# Altium project ETRX_RECU.PrjPcb
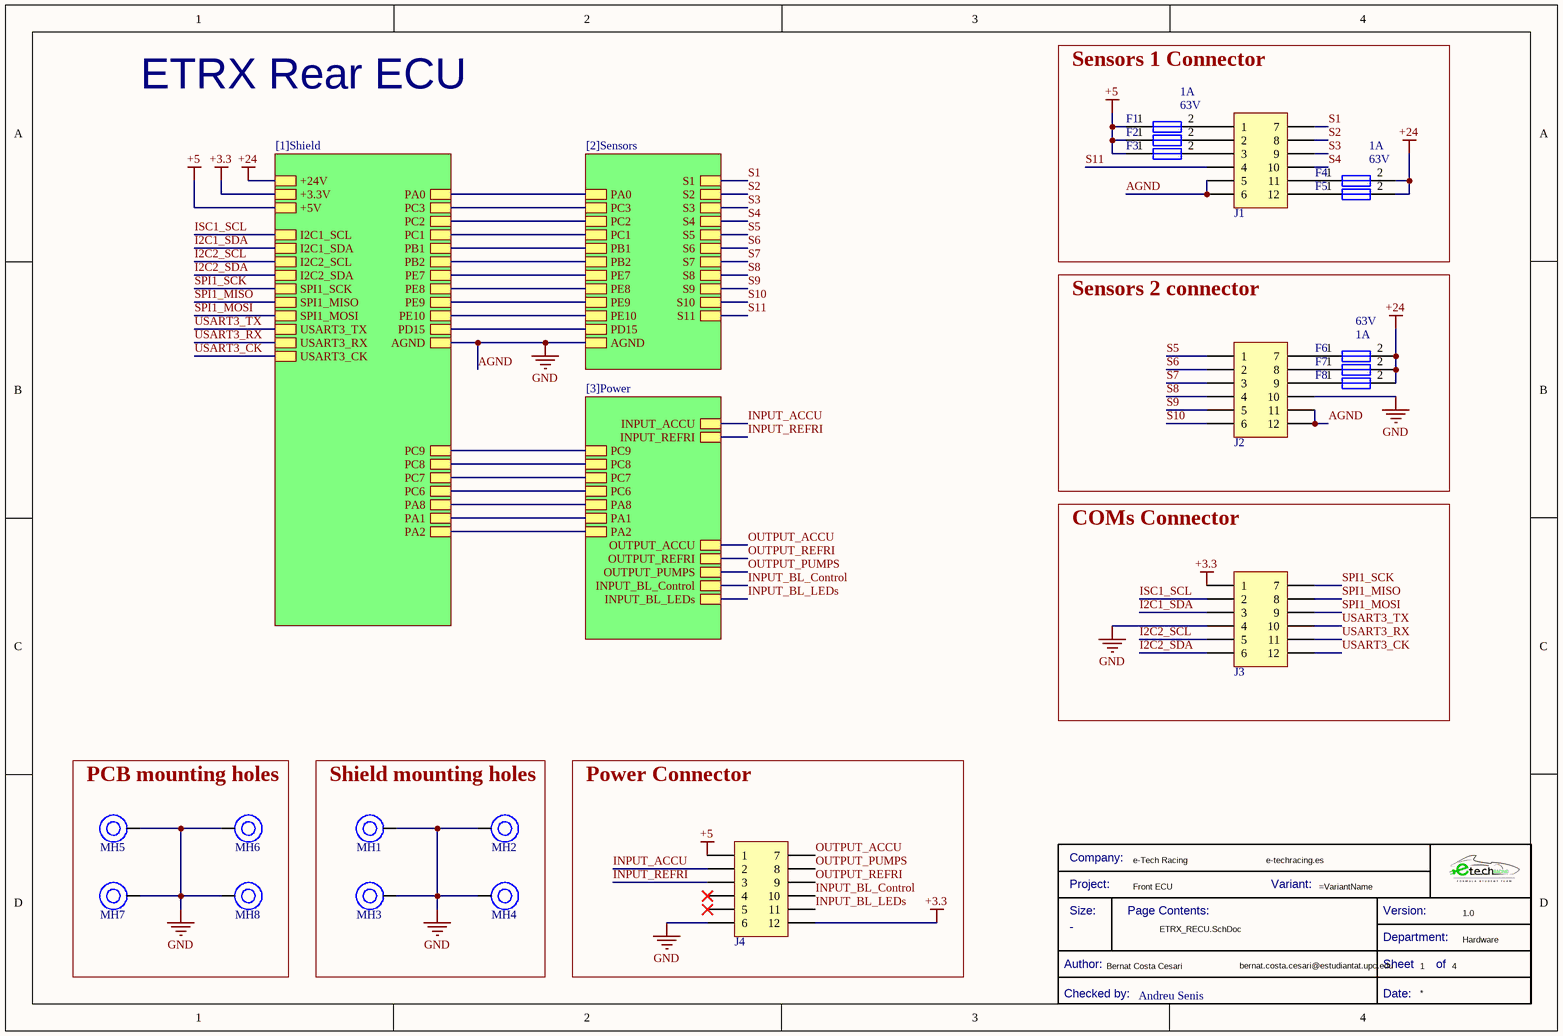
[diagram p0: ETRX_RECU.SchDoc]
Company: e-Tech Racing; Department: Hardware; DesignedByURL: e-techracing.es; DesignerMail: bernat.costa.cesari@estudiantat.upc.edu; DesignerName: Bernat Costa Cesari; Project: Front ECU; ReviewerName: Andreu Senis; Version: 1.0
4 sheets, 79 parts. Net scope: hierarchical (ports join the sheet entries above them; power ports are global).
Board file: ETRX_RECU.PcbDoc
Sheets:
  ETRX_RECU.SchDoc
    [1]Shield = [1]Shield.SchDoc
    [2]Sensors = [2]Sensors.SchDoc
    [3]Power = [3]Power.SchDoc

## Sheet ETRX_RECU.SchDoc
size A4; DocumentNumber: 1; SheetNumber: 1; SheetTotal: 4

### Parts
(Parts that share a designator on the sheet are numbered #1, #2 ... from top to bottom, then left to right.)
*#1  Checked by:: Andreu Senis  (hidden comment: Title Block_template)  (graphical)
F1  Current Rating: 1A  Voltage Rating (DC): 63V  [Fuse_1206]  (hidden comment: 0437001.WRA)
F2  0437001.WRA  [Fuse_1206]  (value not drawn)
F3  0437001.WRA  [Fuse_1206]  (value not drawn)
F4  Current Rating: 1A  Voltage Rating (DC): 63V  [Fuse_1206]  (hidden comment: 0437001.WRA)
F5  0437001.WRA  [Fuse_1206]  (value not drawn)
F6  Current Rating: 1A  Voltage Rating (DC): 63V  [Fuse_1206]  (hidden comment: 0437001.WRA)
F7  0437001.WRA  [Fuse_1206]  (value not drawn)
F8  0437001.WRA  [Fuse_1206]  (value not drawn)
J1  1053101112  [J_NanoFit_2x6_V]  (value not drawn)
J2  1053101112  [J_NanoFit_2x6_V]  (value not drawn)
J3  1053101112  [J_NanoFit_2x6_V]  (value not drawn)
J4  1053101112  [J_NanoFit_2x6_V]  (value not drawn)
MH1  Mounting_Hole_M3  [Mounting_Hole_M3]  (value not drawn)
MH2  Mounting_Hole_M3  [Mounting_Hole_M3]  (value not drawn)
MH3  Mounting_Hole_M3  [Mounting_Hole_M3]  (value not drawn)
MH4  Mounting_Hole_M3  [Mounting_Hole_M3]  (value not drawn)
MH5  Mounting_Hole_M4  [Mounting_Hole_M4]  (value not drawn)
MH6  Mounting_Hole_M4  [Mounting_Hole_M4]  (value not drawn)
MH7  Mounting_Hole_M4  [Mounting_Hole_M4]  (value not drawn)
MH8  Mounting_Hole_M4  [Mounting_Hole_M4]  (value not drawn)

### Blocks framed on the sheet
Sensors 1 Connector: F1-F5 J1
Sensors 2 connector: F6-F8 J2
COMs Connector: J3
PCB mounting holes: MH5-MH8
Shield mounting holes: MH1-MH4
Power Connector: J4

### Sub-sheets
[1]Shield = [1]Shield: +24V, +3.3V, +5V, AGND, I2C1_SCL, I2C1_SDA, I2C2_SCL, I2C2_SDA, SPI1_SCK, SPI1_MISO, SPI1_MOSI, USART3_TX, USART3_RX, USART3_CK, PA2, PA1, PA0, PC3, PC2, PC1, PB1, PB2, PE7, PE8, PE9, PE10, PA8, PC9, PC8, PC7, PC6, PD15
[2]Sensors = [2]Sensors: PC3, PC2, PC1, PB1, PB2, PE7, PE8, PE9, PE10, AGND, S1, S2, S3, S4, S5, S6, S7, S8, S9, S10, PA0, PD15, S11
[3]Power = [3]Power: PA8, PC9, PC8, PC7, PC6, INPUT_ACCU, INPUT_REFRI, OUTPUT_ACCU, OUTPUT_REFRI, OUTPUT_PUMPS, PA1, PA2, INPUT_BL_Control, INPUT_BL_LEDs

### Nets
+3.3: J3.1 J4.12 ; sheet [1]Shield/+3.3V  [project net VDDA]
+5: F1.1 F2.1 F3.1 J4.1 ; sheet [1]Shield/+5V
+24: F4.2 F5.2 F6.2 F7.2 F8.2 ; sheet [1]Shield/+24V  [project net LV tr]
AGND: J1.5 J1.6 J2.10 J2.11 J2.12 J3.4 J4.6 MH1.1 MH2.1 MH3.1 MH4.1 MH5.1 MH6.1 MH7.1 MH8.1 ; sheet [1]Shield/AGND, sheet [2]Sensors/AGND  [also labelled GND]
ACCU_FANS_PWM: sheet [1]Shield/PC9, sheet [3]Power/PC9
ACCU_FANS_RPM: sheet [1]Shield/PC8, sheet [3]Power/PC8
I2C1_SDA: J3.3 ; sheet [1]Shield/I2C1_SDA
I2C2_SCL: J3.5 ; sheet [1]Shield/I2C2_SCL
I2C2_SDA: J3.6 ; sheet [1]Shield/I2C2_SDA
INPUT_ACCU: J4.2 ; sheet [3]Power/INPUT_ACCU
INPUT_BL_Control: J4.10 ; sheet [1]Shield/PA1, sheet [3]Power/PA1, sheet [3]Power/INPUT_BL_Control  [project net BL_Control]
INPUT_BL_LEDs: J4.11 ; sheet [1]Shield/PA2, sheet [3]Power/PA2, sheet [3]Power/INPUT_BL_LEDs  [project net BL_LEDs]
INPUT_REFRI: J4.3 ; sheet [3]Power/INPUT_REFRI
ISC1_SCL: J3.2 ; sheet [1]Shield/I2C1_SCL
OUTPUT_ACCU: J4.7 ; sheet [3]Power/OUTPUT_ACCU
OUTPUT_PUMPS: J4.8 ; sheet [3]Power/OUTPUT_PUMPS
OUTPUT_REFRI: J4.9 ; sheet [3]Power/OUTPUT_REFRI
PA0: sheet [1]Shield/PA0, sheet [2]Sensors/PA0
PA8: sheet [1]Shield/PA8, sheet [3]Power/PA8
PB1: sheet [1]Shield/PB1, sheet [2]Sensors/PB1
PB2: sheet [1]Shield/PB2, sheet [2]Sensors/PB2
PC1: sheet [1]Shield/PC1, sheet [2]Sensors/PC1
PC2: sheet [1]Shield/PC2, sheet [2]Sensors/PC2
PC3: sheet [1]Shield/PC3, sheet [2]Sensors/PC3
PC6: sheet [1]Shield/PC6, sheet [3]Power/PC6
PC7: sheet [1]Shield/PC7, sheet [3]Power/PC7
PD15: sheet [1]Shield/PD15, sheet [2]Sensors/PD15
PE7: sheet [1]Shield/PE7, sheet [2]Sensors/PE7
PE8: sheet [1]Shield/PE8, sheet [2]Sensors/PE8
PE9: sheet [1]Shield/PE9, sheet [2]Sensors/PE9
PE10: sheet [1]Shield/PE10, sheet [2]Sensors/PE10
S1: J1.7 ; sheet [2]Sensors/S1
S2: J1.8 ; sheet [2]Sensors/S2
S3: J1.9 ; sheet [2]Sensors/S3
S4: J1.10 ; sheet [2]Sensors/S4
S5: J2.1 ; sheet [2]Sensors/S5
S6: J2.2 ; sheet [2]Sensors/S6
S7: J2.3 ; sheet [2]Sensors/S7
S8: J2.4 ; sheet [2]Sensors/S8
S9: J2.5 ; sheet [2]Sensors/S9
S10: J2.6 ; sheet [2]Sensors/S10
S11: J1.4 ; sheet [2]Sensors/S11
SPI1_MISO: J3.8 ; sheet [1]Shield/SPI1_MISO  [project net PA6]
SPI1_MOSI: J3.9 ; sheet [1]Shield/SPI1_MOSI  [project net PA7]
SPI1_SCK: J3.7 ; sheet [1]Shield/SPI1_SCK  [project net PA5]
USART3_CK: J3.12 ; sheet [1]Shield/USART3_CK  [project net PD10]
USART3_RX: J3.11 ; sheet [1]Shield/USART3_RX  [project net PD9]
USART3_TX: J3.10 ; sheet [1]Shield/USART3_TX  [project net PD8]
NetF1_2: F1.2 J1.1
NetF2_2: F2.2 J1.2
NetF3_2: F3.2 J1.3
NetF4_1: F4.1 J1.11
NetF5_1: F5.1 J1.12
NetF6_1: F6.1 J2.7
NetF7_1: F7.1 J2.8
NetF8_1: F8.1 J2.9

Not connected (* = marked no-connect by the designer): J4 4* 5*

### Notes on the sheet
- ETRX Rear ECU
- (in symbol Title Block_template) Company:; Project:; Variant:; Size:; Page Contents:; Version:; Department:; Author:; Sheet; of; Checked by:; Date:

### Library data of the parts
*#1 = Title Block_template: Standard Title Block; .Creator: GP; Category: Title Block; .PCBcheck: GP; .SCHcheck: GP; Size: -
F1-F8 = Fuse_1A_63V_1206: Fuse Chip Fast Acting 1A 63V SMD Solder Pad 1206 Ceramic T/R Automotive; Manufacturer: Littelfuse; Fuse Type: Board Mount (Cartridge Style Excluded); Approvals: CSA,cURus; .Creator: DO; Supplier 1: Digi-Key; Manufacturer Part Number: 0437001.WRA; RoHS: Yes; Category: Fuses; Stock 1: 5820; Pricing 1: 1=1,52000, 5=1,47000, 10=1,37600, 50=1,13860, 100=0,94880, 250=0,92508, 500=0,78276, 1000=0,68788 (USD); Mount: Surface Mount; Case/Package: 1206; Case Code (Imperial): 1206; Case Code (Metric): 3216; Min Operating Temperature: -55°C; Max Operating Temperature: 150°C; Packaging: Tape and Reel; Voltage Rating (AC): 63V; ComponentLink1URL: https://www.littelfuse.com/~/media/electronics/datasheets/fuses/littelfuse_fuse_437a_datasheet.pdf.pdf?src-supplier=Digi-Key; ComponentLink1Description: https://www.littelfuse.com/~/media/electronics/datasheets/fuses/littelfuse_fuse_437a_datasheet.pdf.pdf?src-supplier=Digi-Key; Supplier Part Number 1: F10001CT-ND; ComponentLink2Description: Where buy it; ComponentLink2URL: https://www.mouser.es/ProductDetail/Littelfuse/0437001WRA?qs=DXv0QSHKF4z9CJhPXjxR%252BA%3D%3D
  F2 F3 F5 F7 F8: Current Rating: 1A; Voltage Rating (DC): 63V
J1-J4 = J_NanoFit_2x6_V: Nano-Fit Vertical Header, Through Hole, 2.50mm Pitch, Dual Row, 12 Circuits, with Kinked Pins, Tin (Sn) Plating, Black, Glow-Wire Capable, Tray

## Sheet [1]Shield.SchDoc
size A4; DocumentNumber: 2; SheetNumber: 2; SheetTotal: 4
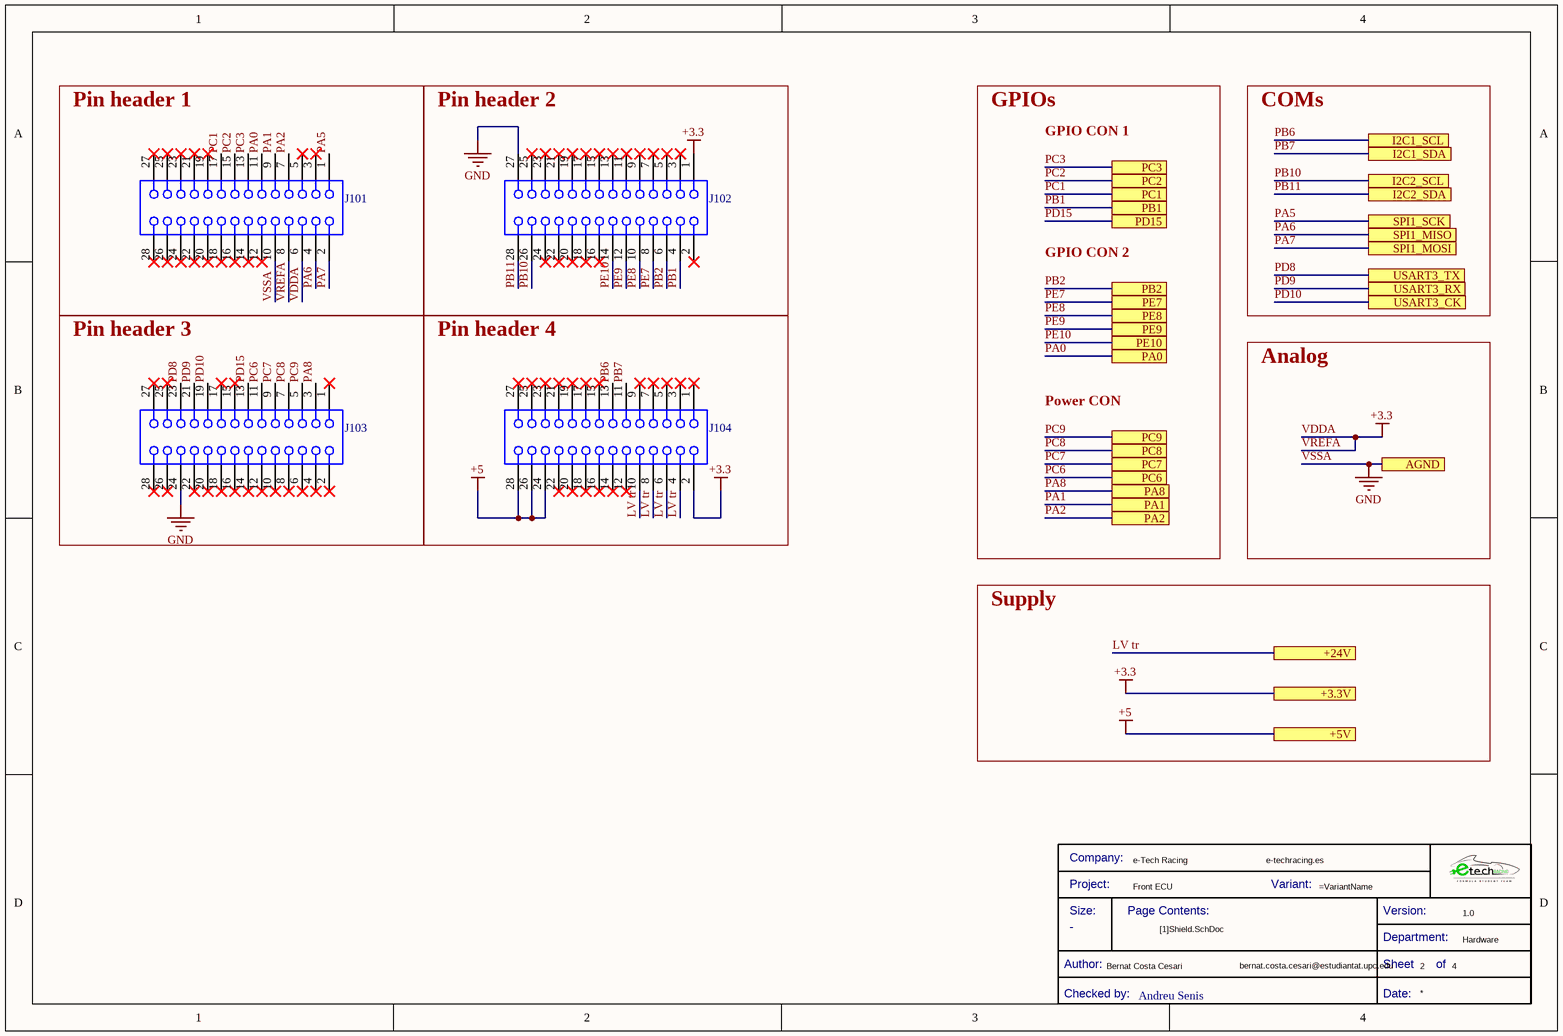
[diagram p1: [1]Shield.SchDoc]

### Parts
(Parts that share a designator on the sheet are numbered #1, #2 ... from top to bottom, then left to right.)
*#2  Checked by:: Andreu Senis  (hidden comment: Title Block_template)  (graphical)
J101  62332821021  [62332821021]  (value not drawn)
J102  62332821021  [62332821021]  (value not drawn)
J103  62332821021  [62332821021]  (value not drawn)
J104  62332821021  [62332821021]  (value not drawn)

### Blocks framed on the sheet
Pin header 1: J101
Pin header 2: J102
Pin header 3: J103
Pin header 4: J104

### Ports
+3.3V, +5V, +24V, AGND, I2C1_SCL, I2C1_SDA, I2C2_SCL, I2C2_SDA, PA0, PA1, PA2, PA8, PB1, PB2, PC1, PC2, PC3, PC6, PC7, PC8, PC9, PD15, PE7, PE8, PE9, PE10, SPI1_MISO, SPI1_MOSI, SPI1_SCK, USART3_CK, USART3_RX, USART3_TX

### Nets
+5: J104.24 J104.26 J104.28 ; port +5V
GND: J101.10 J102.27 J103.24 ; port AGND  [also labelled VSSA]  [project net AGND]
LV tr: J104.4 J104.6 J104.8 J104.10 ; port +24V
VDDA: J101.6 J101.8 J102.1 J104.2 ; port +3.3V  [also labelled +3.3, VREFA]
PA0: J101.11 ; port PA0
PA1: J101.9 ; port PA1  [project net BL_Control]
PA2: J101.7 ; port PA2  [project net BL_LEDs]
PA5: J101.1 ; port SPI1_SCK
PA6: J101.4 ; port SPI1_MISO
PA7: J101.2 ; port SPI1_MOSI
PA8: J103.3 ; port PA8
PB1: J102.4 ; port PB1
PB2: J102.6 ; port PB2
PB6: J104.13 ; port I2C1_SCL  [project net ISC1_SCL]
PB7: J104.11 ; port I2C1_SDA  [project net I2C1_SDA]
PB10: J102.26 ; port I2C2_SCL  [project net I2C2_SCL]
PB11: J102.28 ; port I2C2_SDA  [project net I2C2_SDA]
PC1: J101.17 ; port PC1
PC2: J101.15 ; port PC2
PC3: J101.13 ; port PC3
PC6: J103.11 ; port PC6
PC7: J103.9 ; port PC7
PC8: J103.7 ; port PC8  [project net ACCU_FANS_RPM]
PC9: J103.5 ; port PC9  [project net ACCU_FANS_PWM]
PD8: J103.23 ; port USART3_TX
PD9: J103.21 ; port USART3_RX
PD10: J103.19 ; port USART3_CK
PD15: J103.13 ; port PD15
PE7: J102.8 ; port PE7
PE8: J102.10 ; port PE8
PE9: J102.12 ; port PE9
PE10: J102.14 ; port PE10

Not connected (* = marked no-connect by the designer): J101 3* 5* 12* 14* 16* 18* 19* 20* 21* 22* 23* 24* 25* 26* 27* 28*; J102 2* 3* 5* 7* 9* 11* 13* 15* 16* 17* 18* 19* 20* 21* 22* 23* 24* 25*; J103 1* 2* 4* 6* 8* 10* 12* 14* 15* 16* 17* 18* 20* 22* 25* 26* 27* 28*; J104 1* 3* 5* 7* 9* 12* 14* 15* 16* 17* 18* 19* 20* 21* 22* 23* 25* 27*

### Notes on the sheet
- GPIOs
- COMs
- GPIO CON 1
- GPIO CON 2
- Analog
- Power CON
- Supply
- (in symbol Title Block_template) Company:; Project:; Variant:; Size:; Page Contents:; Version:; Department:; Author:; Sheet; of; Checked by:; Date:

### Library data of the parts
*#2 = Title Block_template: Standard Title Block; .Creator: GP; Category: Title Block; .PCBcheck: GP; .SCHcheck: GP; Size: -
J101-J104 = 62332821021: WR-PHD Socket Header, SMT, Vertical, pitch 1.27mm, 2 Row, 28P; Manufacturer: Wurth Elektronik; Contact Resistance: 20mΩ; Rated Current: 1A; Working Voltage: 250V; Withstanding Voltage: 500V; ComponentLink1Description: Website Link; ComponentLink1URL: https://www.we-online.com/redexpert/article/62332821021?ad; ComponentLink2Description: Datasheet Link; ComponentLink2URL: https://www.we-online.com/redexpert/spec/62332821021?ad; Manufacturer Part Number: 62332821021; Category: Board-to-Board Connectors; Match Code: WR-PHD; Mount: Surface Mount; Operating Temperature Max: 105°C; Operating Temperature Min: -40°C; Packaging: Tape and Reel; Gender: Socket Header; Number of Pins: 28; Number of Rows: 2; Orientation: Vertical; Pitch: 1.27mm

## Sheet [2]Sensors.SchDoc
size A4; DocumentNumber: 3; SheetNumber: 3; SheetTotal: 4
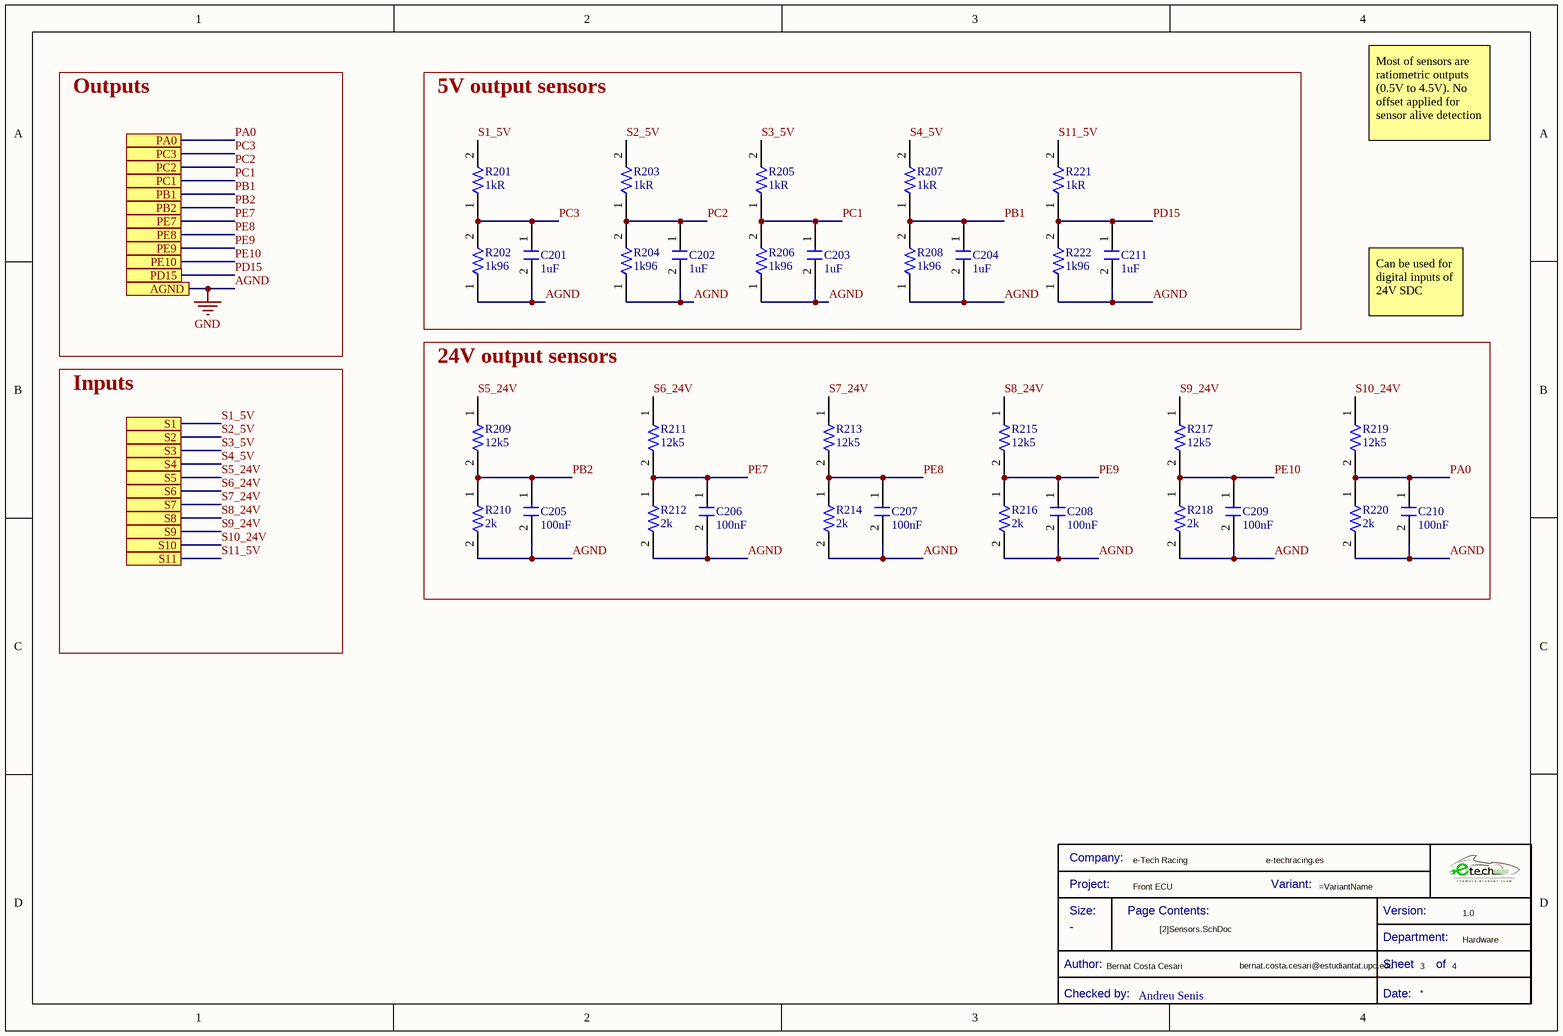
[diagram p2: [2]Sensors.SchDoc]

### Parts
(Parts that share a designator on the sheet are numbered #1, #2 ... from top to bottom, then left to right.)
*#3  Checked by:: Andreu Senis  (hidden comment: Title Block_template)  (graphical)
C201  Capacitance: 1uF  [C0805FNPC-R]  (hidden comment: 885012207103)
C202  Capacitance: 1uF  [C0805FNPC-R]  (hidden comment: 885012207103)
C203  Capacitance: 1uF  [C0805FNPC-R]  (hidden comment: 885012207103)
C204  Capacitance: 1uF  [C0805FNPC-R]  (hidden comment: 885012207103)
C205  Capacitance: 100nF  [C0805FNPC-R]  (hidden comment: 885012207098)
C206  Capacitance: 100nF  [C0805FNPC-R]  (hidden comment: 885012207098)
C207  Capacitance: 100nF  [C0805FNPC-R]  (hidden comment: 885012207098)
C208  Capacitance: 100nF  [C0805FNPC-R]  (hidden comment: 885012207098)
C209  Capacitance: 100nF  [C0805FNPC-R]  (hidden comment: 885012207098)
C210  Capacitance: 100nF  [C0805FNPC-R]  (hidden comment: 885012207098)
C211  Capacitance: 1uF  [C0805FNPC-R]  (hidden comment: 885012207103)
R201  Resistance: 1kR  [R0805FTK]  (hidden comment: CR0805-JW-102ELF)
R202  1k96  [R0805FTK]
R203  Resistance: 1kR  [R0805FTK]  (hidden comment: CR0805-JW-102ELF)
R204  1k96  [R0805FTK]
R205  Resistance: 1kR  [R0805FTK]  (hidden comment: CR0805-JW-102ELF)
R206  1k96  [R0805FTK]
R207  Resistance: 1kR  [R0805FTK]  (hidden comment: CR0805-JW-102ELF)
R208  1k96  [R0805FTK]
R209  12k5  [R0805FTK]
R210  2k  [R0805FTK]
R211  12k5  [R0805FTK]
R212  2k  [R0805FTK]
R213  12k5  [R0805FTK]
R214  2k  [R0805FTK]
R215  12k5  [R0805FTK]
R216  2k  [R0805FTK]
R217  12k5  [R0805FTK]
R218  2k  [R0805FTK]
R219  12k5  [R0805FTK]
R220  2k  [R0805FTK]
R221  Resistance: 1kR  [R0805FTK]  (hidden comment: CR0805-JW-102ELF)
R222  1k96  [R0805FTK]

### Blocks framed on the sheet
5V output sensors: C201-C204 C211 R201-R208 R221 R222
24V output sensors: C205-C210 R209-R220

### Ports
AGND, PA0, PB1, PB2, PC1, PC2, PC3, PD15, PE7, PE8, PE9, PE10, S1, S2, S3, S4, S5, S6, S7, S8, S9, S10, S11

### Nets
AGND: C201.2 C202.2 C203.2 C204.2 C205.2 C206.2 C207.2 C208.2 C209.2 C210.2 C211.2 R202.1 R204.1 R206.1 R208.1 R210.2 R212.2 R214.2 R216.2 R218.2 R220.2 R222.1 ; port AGND  [also labelled GND]
PA0: C210.1 R219.2 R220.1 ; port PA0
PB1: C204.1 R207.1 R208.2 ; port PB1
PB2: C205.1 R209.2 R210.1 ; port PB2
PC1: C203.1 R205.1 R206.2 ; port PC1
PC2: C202.1 R203.1 R204.2 ; port PC2
PC3: C201.1 R201.1 R202.2 ; port PC3
PD15: C211.1 R221.1 R222.2 ; port PD15
PE7: C206.1 R211.2 R212.1 ; port PE7
PE8: C207.1 R213.2 R214.1 ; port PE8
PE9: C208.1 R215.2 R216.1 ; port PE9
PE10: C209.1 R217.2 R218.1 ; port PE10
S1_5V: R201.2 ; port S1  [project net S1]
S2_5V: R203.2 ; port S2  [project net S2]
S3_5V: R205.2 ; port S3  [project net S3]
S4_5V: R207.2 ; port S4  [project net S4]
S5_24V: R209.1 ; port S5  [project net S5]
S6_24V: R211.1 ; port S6  [project net S6]
S7_24V: R213.1 ; port S7  [project net S7]
S8_24V: R215.1 ; port S8  [project net S8]
S9_24V: R217.1 ; port S9  [project net S9]
S10_24V: R219.1 ; port S10  [project net S10]
S11_5V: R221.2 ; port S11  [project net S11]

### Notes on the sheet
- Outputs
- Most of sensors are ratiometric outputs (0.5V to 4.5V). No offset applied for sensor alive detection
- Can be used for digital inputs of 24V SDC
- Inputs
- (in symbol Title Block_template) Company:; Project:; Variant:; Size:; Page Contents:; Version:; Department:; Author:; Sheet; of; Checked by:; Date:

### Library data of the parts
*#3 = Title Block_template: Standard Title Block; .Creator: GP; Category: Title Block; .PCBcheck: GP; .SCHcheck: GP; Size: -
C201-C204 C211 = C1u-50V-0805FNPC-X7R: Multilayer Ceramic Capacitor, Wcap-Csgp Series, 1 F, 10%, X7R, 50 V, 0805 [2012 Metric] Rohs Compliant: Yes; Manufacturer 1: Wurth Electronics; Voltage Rating: 50V; .Creator: GP; Supplier 1: RSComponents; Manufacturer Part Number 1: 885012207103; RoHS: Yes; Category: Ceramic Capacitors; Stock 1: 5100; Pricing 1: 50=0,27200, 250=0,25300, 500=0,22800, 1250=0,20100, 2500=0,17100 (GBP); Mount: Surface Mount; Case/Package: 0805; Case Code (Metric): 2012; Case Code (Imperial): 0805; Min Operating Temperature: -55°C; Max Operating Temperature: 85°C; Packaging: Cut Tape; Dielectric: X7R; Tolerance: 10%; Voltage Rating (DC): 50V; Length: 0.079inch; Width: 0.049inch; Thickness: 0.053inch; REACH SVHC: Unknown; RoHS Compliant: Yes; ComponentLink1URL: http://www.farnell.com/datasheets/1958501.pdf?src-supplier=Farnell; ComponentLink1Description: http://www.farnell.com/datasheets/1958501.pdf?src-supplier=Farnell; ComponentLink2URL: http://www.farnell.com/datasheets/1958501.pdf?src-supplier=Element14; ComponentLink2Description: http://www.farnell.com/datasheets/1958501.pdf?src-supplier=Element14; ComponentLink3URL: https://katalog.we-online.de/pbs/datasheet/885012107003.pdf?src-supplier=Digi-Key; ComponentLink3Description: https://katalog.we-online.de/pbs/datasheet/885012107003.pdf?src-supplier=Digi-Key; ComponentLink4URL: http://www.farnell.com/datasheets/1958501.pdf?src-supplier=Newark; ComponentLink4Description: http://www.farnell.com/datasheets/1958501.pdf?src-supplier=Newark; Supplier Part Number 1: 1813523
C205-C210 = C100n-50V-0805FNPC-X7R: Cap, 0.1ΜF, 50V, 10%, X7R, 0805; Manufacturer 1: Wurth Electronics; .Creator: DR; Supplier 1: RSComponents; Manufacturer Part Number 1: 885012207098; RoHS: Yes; Category: Ceramic Capacitors; Stock 1: 8000; Pricing 1: 100=0,10200, 500=0,07100, 2000=0,06100 (GBP); Mount: Surface Mount; Case/Package: 0805; Case Code (Metric): 2012; Case Code (Imperial): 0805; Min Operating Temperature: -55°C; Max Operating Temperature: 125°C; Packaging: Cut Tape; Voltage Rating: 50V; Dielectric: X7R; Tolerance: 10%; Voltage Rating (DC): 50V; Length: 0.079inch; Width: 0.049inch; Thickness: 0.035inch; REACH SVHC: Unknown; RoHS Compliant: Yes; ComponentLink1URL: http://www.farnell.com/datasheets/1958498.pdf?src-supplier=Farnell; ComponentLink1Description: http://www.farnell.com/datasheets/1958498.pdf?src-supplier=Farnell; ComponentLink2URL: http://www.farnell.com/datasheets/1958498.pdf?src-supplier=Element14; ComponentLink2Description: http://www.farnell.com/datasheets/1958498.pdf?src-supplier=Element14; ComponentLink3URL: https://katalog.we-online.de/pbs/datasheet/885012207098.pdf?src-supplier=Digi-Key; ComponentLink3Description: https://katalog.we-online.de/pbs/datasheet/885012207098.pdf?src-supplier=Digi-Key; ComponentLink4URL: http://www.farnell.com/datasheets/1958498.pdf?src-supplier=Newark; ComponentLink4Description: http://www.farnell.com/datasheets/1958498.pdf?src-supplier=Newark; Supplier Part Number 1: 1813493
R201 R203 R205 R207 R221 = R1k-0805FTK: Res Thick Film 0805 1K Ohm 5% 1/8W ±200ppm/°C Molded SMD SMD Paper Tape on Plastic Reel; Manufacturer 1: Bourns; Voltage Rating (DC): 150V; Power Rating: 125mW; .Creator: GP; Supplier 1: Arrow Electronics; Manufacturer Part Number 1: CR0805-JW-102ELF; RoHS: Yes; Category: Chip SMD Resistors; Stock 1: 27510; Pricing 1: 1=0,05930, 10=0,03510, 25=0,01790, 100=0,00800, 250=0,00790, 500=0,00590, 1000=0,00360, 3000=0,00350, 6000=0,00250 (USD); Mount: Surface Mount; Case/Package: 0805; Number of Pins: 2; Contact Plating: Tin; Case Code (Metric): 2012; Case Code (Imperial): 0805; Min Operating Temperature: -55°C; Max Operating Temperature: 155°C; Resistor Type: Thick Film; Tolerance: 5%; Temperature Coefficient: 200ppm/°C; Features: Moisture Resistant; Package Quantity: 1; Packaging: Tape and Reel; Voltage Rating: 150V; Number of Terminations: 2; Termination: SMD/SMT; Max Power Dissipation: 125mW; Length: 2mm; Width: 1.25mm; Height: 0.5mm; Thickness: 508um; Depth: 1.25mm; Radiation Hardening: No; Lead Free: Lead Free; REACH SVHC: No SVHC; Military Standard: Not; ComponentLink1URL: https://datasheet.ciiva.com/11821/0900766b80fcdb72-11821134.pdf?src-supplier=RSComponents; ComponentLink1Description: https://datasheet.ciiva.com/11821/0900766b80fcdb72-11821134.pdf?src-supplier=RSComponents; ComponentLink2URL: https://datasheet.ciiva.com/15225/getdatasheetpartid-78155-15225381.pdf?src-supplier=Verical; ComponentLink2Description: https://datasheet.ciiva.com/15225/getdatasheetpartid-78155-15225381.pdf?src-supplier=Verical; ComponentLink3URL: https://datasheet.ciiva.com/22693/1902866-22693253.pdf?src-supplier=Element14; ComponentLink3Description: https://datasheet.ciiva.com/22693/1902866-22693253.pdf?src-supplier=Element14; ComponentLink4URL: https://datasheet.ciiva.com/7986/1856384-7986184.pdf?src-supplier=Element14; ComponentLink4Description: https://datasheet.ciiva.com/7986/1856384-7986184.pdf?src-supplier=Element14; ComponentLink5URL: https://datasheet.ciiva.com/7985/1856384-7985867.pdf?src-supplier=Element14; ComponentLink5Description: https://datasheet.ciiva.com/7985/1856384-7985867.pdf?src-supplier=Element14; ComponentLink6URL: https://datasheet.ciiva.com/30242/159chpreztr-30242765.pdf?src-supplier=Onlinecomponents.com; ComponentLink6Description: https://datasheet.ciiva.com/30242/159chpreztr-30242765.pdf?src-supplier=Onlinecomponents.com; ComponentLink7URL: https://datasheet.ciiva.com/6547/chpreztr-6547359.pdf?src-supplier=Digi-Key; ComponentLink7Description: https://datasheet.ciiva.com/6547/chpreztr-6547359.pdf?src-supplier=Digi-Key; Supplier Part Number 1: CR0805-JW-102ELF
R202 R204 R206 R208 R222 = R1k96-0805FTK
R209 R211 R213 R215 R217 R219 = R12k5-0805FTK
R210 R212 R214 R216 R218 R220 = R2k-0805FTK

## Sheet [3]Power.SchDoc
size A4; DocumentNumber: 4; SheetNumber: 4; SheetTotal: 4
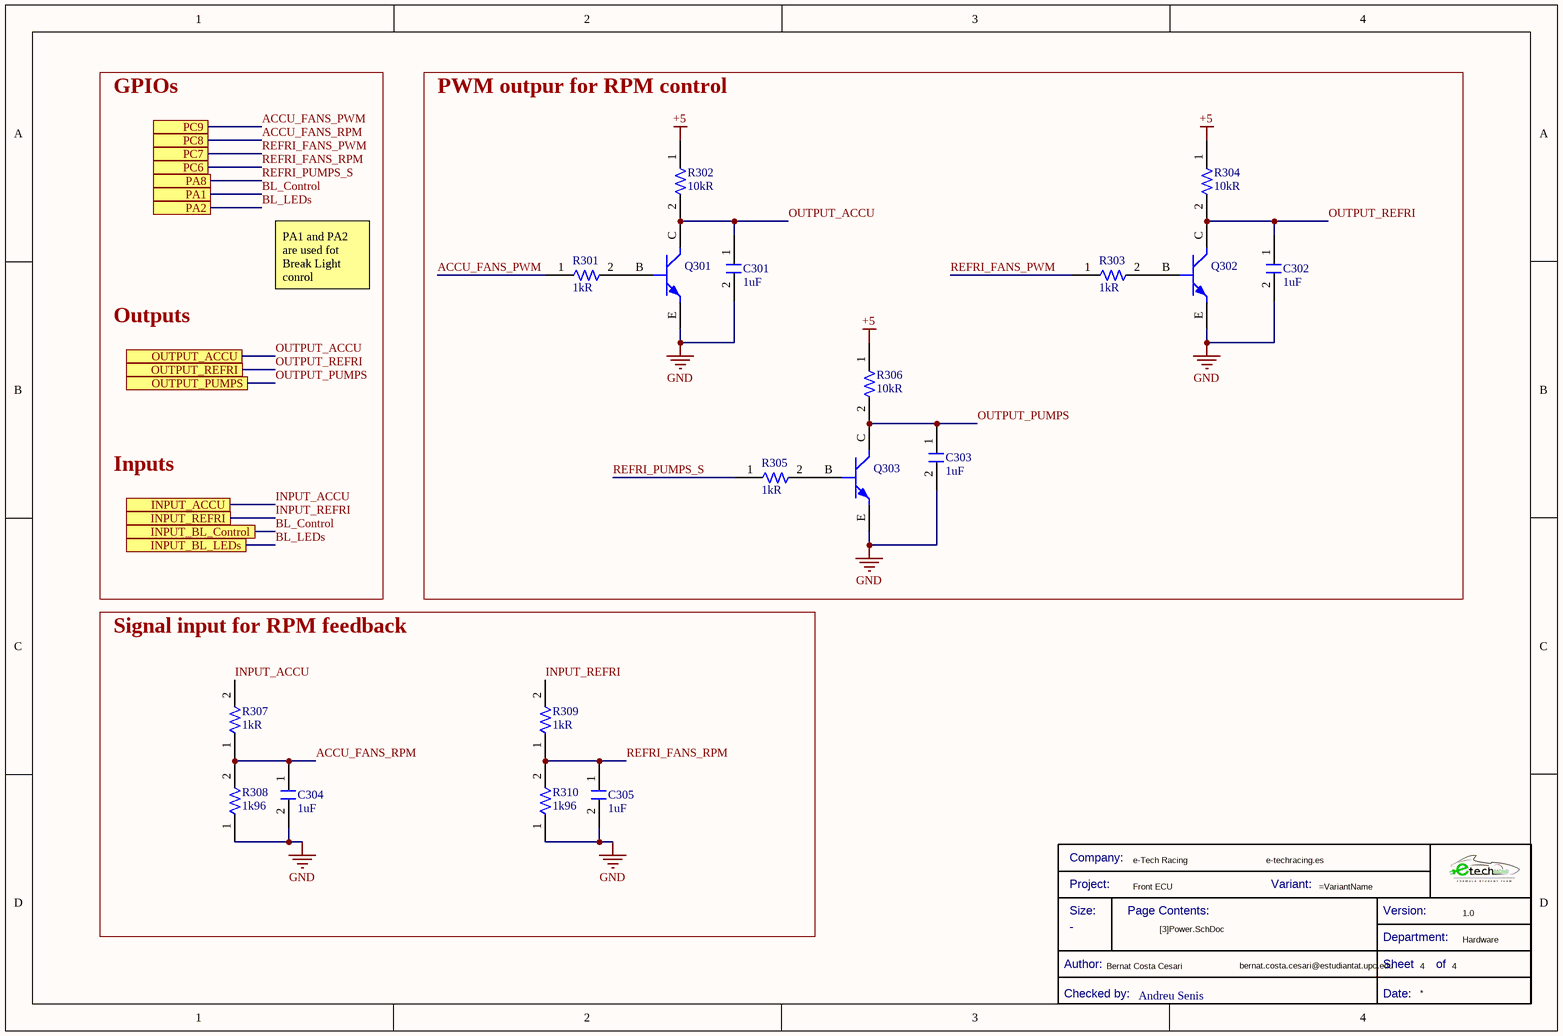
[diagram p3: [3]Power.SchDoc]

### Parts
(Parts that share a designator on the sheet are numbered #1, #2 ... from top to bottom, then left to right.)
*#4  Checked by:: Andreu Senis  (hidden comment: Title Block_template)  (graphical)
C301  Capacitance: 1uF  [C0805FNPC-R]  (hidden comment: 885012207103)
C302  Capacitance: 1uF  [C0805FNPC-R]  (hidden comment: 885012207103)
C303  Capacitance: 1uF  [C0805FNPC-R]  (hidden comment: 885012207103)
C304  Capacitance: 1uF  [C0805FNPC-R]  (hidden comment: 885012207103)
C305  Capacitance: 1uF  [C0805FNPC-R]  (hidden comment: 885012207103)
Q301  BC817-25LT1G  [TRT-NPN-0.5/45-SOT23]  (value not drawn)
Q302  BC817-25LT1G  [TRT-NPN-0.5/45-SOT23]  (value not drawn)
Q303  BC817-25LT1G  [TRT-NPN-0.5/45-SOT23]  (value not drawn)
R301  Resistance: 1kR  [R0805FTK]  (hidden comment: CR0805-JW-102ELF)
R302  Resistance: 10kR  [R0805FTK]  (hidden comment: CR0805-JW-103ELF)
R303  Resistance: 1kR  [R0805FTK]  (hidden comment: CR0805-JW-102ELF)
R304  Resistance: 10kR  [R0805FTK]  (hidden comment: CR0805-JW-103ELF)
R305  Resistance: 1kR  [R0805FTK]  (hidden comment: CR0805-JW-102ELF)
R306  Resistance: 10kR  [R0805FTK]  (hidden comment: CR0805-JW-103ELF)
R307  Resistance: 1kR  [R0805FTK]  (hidden comment: CR0805-JW-102ELF)
R308  1k96  [R0805FTK]
R309  Resistance: 1kR  [R0805FTK]  (hidden comment: CR0805-JW-102ELF)
R310  1k96  [R0805FTK]

### Blocks framed on the sheet
PWM outpur for RPM control: C301-C303 Q301-Q303 R301-R306
Signal input for RPM feedback: C304 C305 R307-R310

### Ports
INPUT_ACCU, INPUT_BL_Control, INPUT_BL_LEDs, INPUT_REFRI, OUTPUT_ACCU, OUTPUT_PUMPS, OUTPUT_REFRI, PA1, PA2, PA8, PC6, PC7, PC8, PC9

### Nets
+5: R302.1 R304.1 R306.1
GND: C301.2 C302.2 C303.2 C304.2 C305.2 Q301.E Q302.E Q303.E R308.1 R310.1  [project net AGND]
ACCU_FANS_PWM: R301.1 ; port PC9
ACCU_FANS_RPM: C304.1 R307.1 R308.2 ; port PC8
BL_Control: port PA1, port INPUT_BL_Control
BL_LEDs: port PA2, port INPUT_BL_LEDs
INPUT_ACCU: R307.2 ; port INPUT_ACCU
INPUT_REFRI: R309.2 ; port INPUT_REFRI
OUTPUT_ACCU: C301.1 Q301.C R302.2 ; port OUTPUT_ACCU
OUTPUT_PUMPS: C303.1 Q303.C R306.2 ; port OUTPUT_PUMPS
OUTPUT_REFRI: C302.1 Q302.C R304.2 ; port OUTPUT_REFRI
REFRI_FANS_PWM: R303.1 ; port PC7  [project net PC7]
REFRI_FANS_RPM: C305.1 R309.1 R310.2 ; port PC6  [project net PC6]
REFRI_PUMPS_S: R305.1 ; port PA8  [project net PA8]
NetQ301_B: Q301.B R301.2
NetQ302_B: Q302.B R303.2
NetQ303_B: Q303.B R305.2

### Notes on the sheet
- GPIOs
- PA1 and PA2 are used fot Break Light conrol
- Outputs
- Inputs
- (in symbol Title Block_template) Company:; Project:; Variant:; Size:; Page Contents:; Version:; Department:; Author:; Sheet; of; Checked by:; Date:

### Library data of the parts
*#4 = Title Block_template: Standard Title Block; .Creator: GP; Category: Title Block; .PCBcheck: GP; .SCHcheck: GP; Size: -
C301-C305 = C1u-50V-0805FNPC-X7R: as C201 on sheet [2]Sensors; Supplier 1: RSComponents; Manufacturer Part Number 1: 885012207103; RoHS: Yes; Category: Ceramic Capacitors; Stock 1: 5100; Pricing 1: 50=0,27200, 250=0,25300, 500=0,22800, 1250=0,20100, 2500=0,17100 (GBP); Mount: Surface Mount; Case/Package: 0805; Case Code (Metric): 2012; Case Code (Imperial): 0805; Min Operating Temperature: -55°C; Max Operating Temperature: 85°C; Packaging: Cut Tape; Dielectric: X7R; Tolerance: 10%; Voltage Rating (DC): 50V; Length: 0.079inch; Width: 0.049inch; Thickness: 0.053inch; REACH SVHC: Unknown; RoHS Compliant: Yes; ComponentLink1URL: http://www.farnell.com/datasheets/1958501.pdf?src-supplier=Farnell; ComponentLink1Description: http://www.farnell.com/datasheets/1958501.pdf?src-supplier=Farnell; ComponentLink2URL: http://www.farnell.com/datasheets/1958501.pdf?src-supplier=Element14; ComponentLink2Description: http://www.farnell.com/datasheets/1958501.pdf?src-supplier=Element14; ComponentLink3URL: https://katalog.we-online.de/pbs/datasheet/885012107003.pdf?src-supplier=Digi-Key; ComponentLink3Description: https://katalog.we-online.de/pbs/datasheet/885012107003.pdf?src-supplier=Digi-Key; ComponentLink4URL: http://www.farnell.com/datasheets/1958501.pdf?src-supplier=Newark; ComponentLink4Description: http://www.farnell.com/datasheets/1958501.pdf?src-supplier=Newark; Supplier Part Number 1: 1813523
Q301-Q303 = TRT-NPN-0.5/45-SOT23: ON Semi BC817-25LT1G NPN Bipolar Transistor; 0.5 A; 45 V; 3-Pin SOT-23; Collector Emitter Voltage (VCEO): 45V; Max Collector Current: 500mA; Collector Base Voltage (VCBO): 50V; Power Dissipation: 300mW; hFE Min: 160; Transition Frequency: 100MHz; Emitter Base Voltage (VEBO): 5V; Element Configuration: Single; Collector-emitter Voltage-Max: 700mV; Number of Elements: 1; .Creator: GP; Category: Transistor; ComponentLink1Description: Datasheet; ComponentLink1URL: *; ComponentLink2Description: Where buy it; ComponentLink2URL: *; Package: *; Type: *; Manufacturer: *; Manufacturer part number: *; Supplier: *; Packaging: *; Max operating temperature: *; Min operating temperature: *; Max power dissipation: *; Power rating: *; RoHS: *; Polarity: *; Vce max: *; Ic max: *; Gain: *; Supplier 1: Digi-Key; Pricing 1: 1=0,20000, 10=0,18500, 100=0,10080, 500=0,06204, 1000=0,04229 (USD); Case/Package: SOT-23-3; Number of Pins: 3; Contact Plating: Tin,Matte; Package Quantity: 1; Collector Emitter Breakdown Voltage: 45V; Max Breakdown Voltage: 45V; Max Frequency: 100MHz; Current Rating: 500mA; Series: -; Frequency: 100MHz; Collector Emitter Saturation Voltage: 700mV; Gain Bandwidth Product: 100MHz; Length: 2.9mm; Width: 1.3mm; Height: 0.94mm; Radiation Hardening: No; Lead Free: Lead Free; Halogen Free: Halogen Free; RoHS Compliant: Yes; REACH SVHC: No SVHC; ComponentLink3URL: https://datasheet.ciiva.com/27748/2010413-27748829.pdf?src-supplier=Jameco; ComponentLink3Description: https://datasheet.ciiva.com/27748/2010413-27748829.pdf?src-supplier=Jameco; ComponentLink4URL: https://datasheet.ciiva.com/15138/getdatasheetpartid-38405-15138602.pdf?src-supplier=Verical; ComponentLink4Description: https://datasheet.ciiva.com/15138/getdatasheetpartid-38405-15138602.pdf?src-supplier=Verical; ComponentLink5URL: https://datasheet.ciiva.com/1196/bc817-16lt1-d-1196558.pdf?src-supplier=Element14; ComponentLink5Description: https://datasheet.ciiva.com/1196/bc817-16lt1-d-1196558.pdf?src-supplier=Element14; ComponentLink6URL: https://datasheet.ciiva.com/22641/bc817-16lt1-d-22641013.pdf?src-supplier=Farnell; ComponentLink6Description: https://datasheet.ciiva.com/22641/bc817-16lt1-d-22641013.pdf?src-supplier=Farnell; ComponentLink7URL: https://datasheet.ciiva.com/22664/bc817-16lt1-d-22664204.pdf?src-supplier=Element14; ComponentLink7Description: https://datasheet.ciiva.com/22664/bc817-16lt1-d-22664204.pdf?src-supplier=Element14; ComponentLink8URL: https://datasheet.ciiva.com/22664/1842041-22664101.pdf?src-supplier=Element14; ComponentLink8Description: https://datasheet.ciiva.com/22664/1842041-22664101.pdf?src-supplier=Element14; ComponentLink9URL: https://datasheet.ciiva.com/4722/bc817-16lt1-d-104560-4722229.pdf?src-supplier=Mouser; ComponentLink9Description: https://datasheet.ciiva.com/4722/bc817-16lt1-d-104560-4722229.pdf?src-supplier=Mouser; ComponentLink10URL: https://datasheet.ciiva.com/1195/bc817-16lt1-d-1195763.pdf?src-supplier=Element14; ComponentLink10Description: https://datasheet.ciiva.com/1195/bc817-16lt1-d-1195763.pdf?src-supplier=Element14; ComponentLink11URL: https://datasheet.ciiva.com/1195/bc817-16lt1-d-1195764.pdf?src-supplier=Element14; ComponentLink11Description: https://datasheet.ciiva.com/1195/bc817-16lt1-d-1195764.pdf?src-supplier=Element14; ComponentLink12URL: https://datasheet.ciiva.com/11197/bc817-16lt1-d-11197514.pdf?src-supplier=Avnet; ComponentLink12Description: https://datasheet.ciiva.com/11197/bc817-16lt1-d-11197514.pdf?src-supplier=Avnet; ComponentLink13URL: https://datasheet.ciiva.com/25996/bc817-16lt1-d-25996327.pdf?src-supplier=Avnet+Europe; ComponentLink13Description: https://datasheet.ciiva.com/25996/bc817-16lt1-d-25996327.pdf?src-supplier=Avnet+Europe; ComponentLink14URL: https://datasheet.ciiva.com/976/bc817-16lt1-d-976357.pdf?src-supplier=Digi-Key; ComponentLink14Description: https://datasheet.ciiva.com/976/bc817-16lt1-d-976357.pdf?src-supplier=Digi-Key; ComponentLink15URL: https://datasheet.ciiva.com/976/bc817-16lt1-d-976358.pdf?src-supplier=Digi-Key; ComponentLink15Description: https://datasheet.ciiva.com/976/bc817-16lt1-d-976358.pdf?src-supplier=Digi-Key; ComponentLink16URL: https://datasheet.ciiva.com/976/bc817-16lt1-d-976356.pdf?src-supplier=Digi-Key; ComponentLink16Description: https://datasheet.ciiva.com/976/bc817-16lt1-d-976356.pdf?src-supplier=Digi-Key; Supplier Part Number 1: BC817-25LT1GOSCT-ND
R301 R303 R305 R307 R309 = R1k-0805FTK: as R201 on sheet [2]Sensors; Supplier 1: Arrow Electronics; Manufacturer Part Number 1: CR0805-JW-102ELF; RoHS: Yes; Category: Chip SMD Resistors; Stock 1: 27510; Pricing 1: 1=0,05930, 10=0,03510, 25=0,01790, 100=0,00800, 250=0,00790, 500=0,00590, 1000=0,00360, 3000=0,00350, 6000=0,00250 (USD); Mount: Surface Mount; Case/Package: 0805; Number of Pins: 2; Contact Plating: Tin; Case Code (Metric): 2012; Case Code (Imperial): 0805; Min Operating Temperature: -55°C; Max Operating Temperature: 155°C; Resistor Type: Thick Film; Tolerance: 5%; Temperature Coefficient: 200ppm/°C; Features: Moisture Resistant; Package Quantity: 1; Packaging: Tape and Reel; Voltage Rating: 150V; Number of Terminations: 2; Termination: SMD/SMT; Max Power Dissipation: 125mW; Length: 2mm; Width: 1.25mm; Height: 0.5mm; Thickness: 508um; Depth: 1.25mm; Radiation Hardening: No; Lead Free: Lead Free; REACH SVHC: No SVHC; Military Standard: Not; ComponentLink1URL: https://datasheet.ciiva.com/11821/0900766b80fcdb72-11821134.pdf?src-supplier=RSComponents; ComponentLink1Description: https://datasheet.ciiva.com/11821/0900766b80fcdb72-11821134.pdf?src-supplier=RSComponents; ComponentLink2URL: https://datasheet.ciiva.com/15225/getdatasheetpartid-78155-15225381.pdf?src-supplier=Verical; ComponentLink2Description: https://datasheet.ciiva.com/15225/getdatasheetpartid-78155-15225381.pdf?src-supplier=Verical; ComponentLink3URL: https://datasheet.ciiva.com/22693/1902866-22693253.pdf?src-supplier=Element14; ComponentLink3Description: https://datasheet.ciiva.com/22693/1902866-22693253.pdf?src-supplier=Element14; ComponentLink4URL: https://datasheet.ciiva.com/7986/1856384-7986184.pdf?src-supplier=Element14; ComponentLink4Description: https://datasheet.ciiva.com/7986/1856384-7986184.pdf?src-supplier=Element14; ComponentLink5URL: https://datasheet.ciiva.com/7985/1856384-7985867.pdf?src-supplier=Element14; ComponentLink5Description: https://datasheet.ciiva.com/7985/1856384-7985867.pdf?src-supplier=Element14; ComponentLink6URL: https://datasheet.ciiva.com/30242/159chpreztr-30242765.pdf?src-supplier=Onlinecomponents.com; ComponentLink6Description: https://datasheet.ciiva.com/30242/159chpreztr-30242765.pdf?src-supplier=Onlinecomponents.com; ComponentLink7URL: https://datasheet.ciiva.com/6547/chpreztr-6547359.pdf?src-supplier=Digi-Key; ComponentLink7Description: https://datasheet.ciiva.com/6547/chpreztr-6547359.pdf?src-supplier=Digi-Key; Supplier Part Number 1: CR0805-JW-102ELF
R302 R304 R306 = R10k-0805FTK: BOURNS         CR0805-JW-103ELF            Surface Mount Chip Resistor, Thick Film, CR Series, 10 kohm, 125 mW,  5%, 150 V; Temperature Coefficient: 200ppm/°C; Power Rating: 125mW; Voltage Rating: 150V; Voltage Rating (DC): 100V; .Creator: DR; Supplier 1: Arrow Electronics; Manufacturer 1: Bourns; Manufacturer Part Number 1: CR0805-JW-103ELF; RoHS: Yes; Category: Chip SMD Resistors; Stock 1: 57566; Pricing 1: 1=0,05790, 10=0,01540, 25=0,01340, 100=0,00340 (USD); Mount: Surface Mount; Case/Package: 0805; Number of Pins: 2; Contact Plating: Tin; Case Code (Metric): 2012; Case Code (Imperial): 0805; Min Operating Temperature: -55°C; Max Operating Temperature: 155°C; Tolerance: 5%; Resistor Type: Thick Film; Package Quantity: 1; Packaging: Tape and Reel; Number of Terminations: 2; Termination: SMD/SMT; Max Power Dissipation: 125mW; Features: Moisture Resistant; Series: CR0805; Construction: Rectangular; Resistance Tolerance: 5%; Technology: THICK FILM; Length: 2mm; Width: 1.25mm; Height: 0.5mm; Depth: 1.25mm; Thickness: 508um; Radiation Hardening: No; REACH SVHC: No SVHC; Military Standard: Not; RoHS Compliant: Yes; ComponentLink1URL: https://datasheet.ciiva.com/11821/0900766b80fcdb72-11821135.pdf?src-supplier=RSComponents; ComponentLink1Description: https://datasheet.ciiva.com/11821/0900766b80fcdb72-11821135.pdf?src-supplier=RSComponents; ComponentLink2URL: https://datasheet.ciiva.com/9122/chpreztr-9122374.pdf?src-supplier=Avnet; ComponentLink2Description: https://datasheet.ciiva.com/9122/chpreztr-9122374.pdf?src-supplier=Avnet; ComponentLink3URL: https://datasheet.ciiva.com/22693/1902866-22693254.pdf?src-supplier=Element14; ComponentLink3Description: https://datasheet.ciiva.com/22693/1902866-22693254.pdf?src-supplier=Element14; ComponentLink4URL: https://datasheet.ciiva.com/7986/691949-7986187.pdf?src-supplier=Element14; ComponentLink4Description: https://datasheet.ciiva.com/7986/691949-7986187.pdf?src-supplier=Element14; ComponentLink5URL: https://datasheet.ciiva.com/30065/159chpreztr-30065976.pdf?src-supplier=Onlinecomponents.com; ComponentLink5Description: https://datasheet.ciiva.com/30065/159chpreztr-30065976.pdf?src-supplier=Onlinecomponents.com; ComponentLink6URL: https://datasheet.ciiva.com/16783/70154685-16783482.pdf?src-supplier=Allied+Electronics; ComponentLink6Description: https://datasheet.ciiva.com/16783/70154685-16783482.pdf?src-supplier=Allied+Electronics; ComponentLink7URL: https://datasheet.ciiva.com/5548/chpreztr-5548491.pdf?src-supplier=Mouser; ComponentLink7Description: https://datasheet.ciiva.com/5548/chpreztr-5548491.pdf?src-supplier=Mouser; ComponentLink8URL: https://datasheet.ciiva.com/6559/chpreztr-6559900.pdf?src-supplier=Digi-Key; ComponentLink8Description: https://datasheet.ciiva.com/6559/chpreztr-6559900.pdf?src-supplier=Digi-Key; ComponentLink9URL: https://datasheet.ciiva.com/6559/chpreztr-6559901.pdf?src-supplier=Digi-Key; ComponentLink9Description: https://datasheet.ciiva.com/6559/chpreztr-6559901.pdf?src-supplier=Digi-Key; ComponentLink10URL: https://datasheet.ciiva.com/7985/1856384-7985869.pdf?src-supplier=Element14; ComponentLink10Description: https://datasheet.ciiva.com/7985/1856384-7985869.pdf?src-supplier=Element14; ComponentLink11URL: https://datasheet.ciiva.com/48692/001055517-da-01-en-smd-wid-cr0805-jw-103elf-10k-ohm-1-8w-48692118.pdf?src-supplier=Conrad; ComponentLink11Description: https://datasheet.ciiva.com/48692/001055517-da-01-en-smd-wid-cr0805-jw-103elf-10k-ohm-1-8w-48692118.pdf?src-supplier=Conrad; Supplier Part Number 1: CR0805-JW-103ELF
R308 R310 = R1k96-0805FTK

## Nets that join several sheets
+5: ETRX_RECU (F1.1 F2.1 F3.1 J4.1), [1]Shield (J104.24 J104.26 J104.28), [3]Power (R302.1 R304.1 R306.1)
AGND: ETRX_RECU (15 pins), [1]Shield (J101.10 J102.27 J103.24), [2]Sensors (22 pins), [3]Power (10 pins)
LV tr: ETRX_RECU (5 pins), [1]Shield (J104.4 J104.6 J104.8 J104.10)
VDDA: ETRX_RECU (J3.1 J4.12), [1]Shield (J101.6 J101.8 J102.1 J104.2)
ACCU_FANS_PWM: [1]Shield (J103.5), [3]Power (R301.1)
ACCU_FANS_RPM: [1]Shield (J103.7), [3]Power (C304.1 R307.1 R308.2)
BL_Control: ETRX_RECU (J4.10), [1]Shield (J101.9)
BL_LEDs: ETRX_RECU (J4.11), [1]Shield (J101.7)
I2C1_SDA: ETRX_RECU (J3.3), [1]Shield (J104.11)
I2C2_SCL: ETRX_RECU (J3.5), [1]Shield (J102.26)
I2C2_SDA: ETRX_RECU (J3.6), [1]Shield (J102.28)
INPUT_ACCU: ETRX_RECU (J4.2), [3]Power (R307.2)
INPUT_REFRI: ETRX_RECU (J4.3), [3]Power (R309.2)
ISC1_SCL: ETRX_RECU (J3.2), [1]Shield (J104.13)
OUTPUT_ACCU: ETRX_RECU (J4.7), [3]Power (C301.1 Q301.C R302.2)
OUTPUT_PUMPS: ETRX_RECU (J4.8), [3]Power (C303.1 Q303.C R306.2)
OUTPUT_REFRI: ETRX_RECU (J4.9), [3]Power (C302.1 Q302.C R304.2)
PA0: [1]Shield (J101.11), [2]Sensors (C210.1 R219.2 R220.1)
PA5: ETRX_RECU (J3.7), [1]Shield (J101.1)
PA6: ETRX_RECU (J3.8), [1]Shield (J101.4)
PA7: ETRX_RECU (J3.9), [1]Shield (J101.2)
PA8: [1]Shield (J103.3), [3]Power (R305.1)
PB1: [1]Shield (J102.4), [2]Sensors (C204.1 R207.1 R208.2)
PB2: [1]Shield (J102.6), [2]Sensors (C205.1 R209.2 R210.1)
PC1: [1]Shield (J101.17), [2]Sensors (C203.1 R205.1 R206.2)
PC2: [1]Shield (J101.15), [2]Sensors (C202.1 R203.1 R204.2)
PC3: [1]Shield (J101.13), [2]Sensors (C201.1 R201.1 R202.2)
PC6: [1]Shield (J103.11), [3]Power (C305.1 R309.1 R310.2)
PC7: [1]Shield (J103.9), [3]Power (R303.1)
PD8: ETRX_RECU (J3.10), [1]Shield (J103.23)
PD9: ETRX_RECU (J3.11), [1]Shield (J103.21)
PD10: ETRX_RECU (J3.12), [1]Shield (J103.19)
PD15: [1]Shield (J103.13), [2]Sensors (C211.1 R221.1 R222.2)
PE7: [1]Shield (J102.8), [2]Sensors (C206.1 R211.2 R212.1)
PE8: [1]Shield (J102.10), [2]Sensors (C207.1 R213.2 R214.1)
PE9: [1]Shield (J102.12), [2]Sensors (C208.1 R215.2 R216.1)
PE10: [1]Shield (J102.14), [2]Sensors (C209.1 R217.2 R218.1)
S1: ETRX_RECU (J1.7), [2]Sensors (R201.2)
S2: ETRX_RECU (J1.8), [2]Sensors (R203.2)
S3: ETRX_RECU (J1.9), [2]Sensors (R205.2)
S4: ETRX_RECU (J1.10), [2]Sensors (R207.2)
S5: ETRX_RECU (J2.1), [2]Sensors (R209.1)
S6: ETRX_RECU (J2.2), [2]Sensors (R211.1)
S7: ETRX_RECU (J2.3), [2]Sensors (R213.1)
S8: ETRX_RECU (J2.4), [2]Sensors (R215.1)
S9: ETRX_RECU (J2.5), [2]Sensors (R217.1)
S10: ETRX_RECU (J2.6), [2]Sensors (R219.1)
S11: ETRX_RECU (J1.4), [2]Sensors (R221.2)